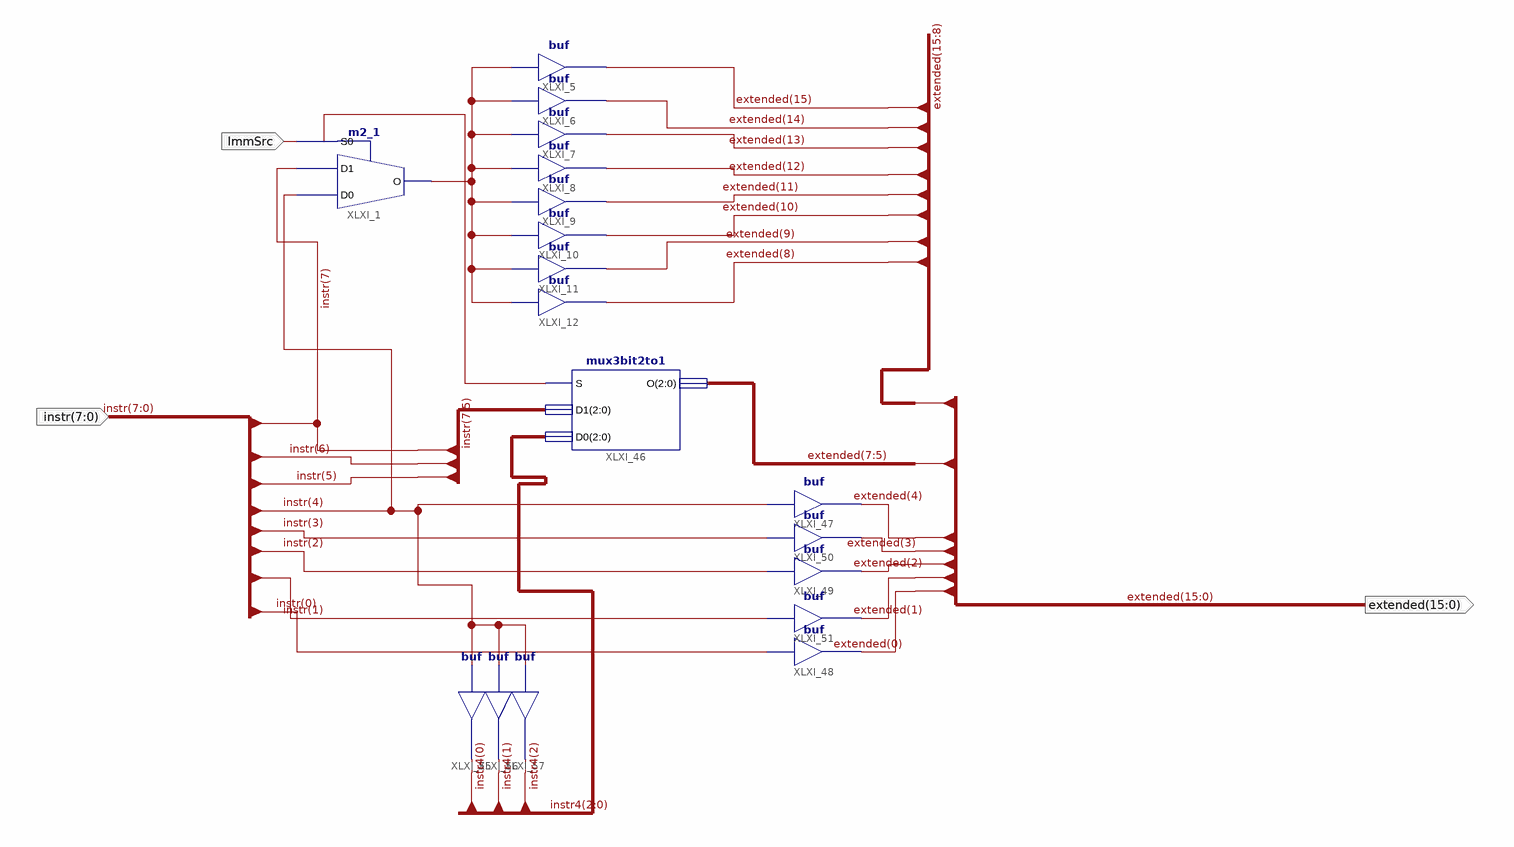
[diagram p0: schematic sheet 1]
// Xilinx ISE schematic extend.sch (spartan3e) as structural Verilog: 18 symbols, 3 ports
module extend (
  input  ImmSrc,
  input  [7:0] instr,
  output [15:0] extended
);

  wire XLXN_53, XLXN_79;
  wire [2:0] instr4;

  m2_1 XLXI_1 (.D0(instr[4]), .D1(instr[7]), .S0(ImmSrc), .O(XLXN_53));
  buf XLXI_5 (extended[15], XLXN_53);
  buf XLXI_6 (extended[14], XLXN_53);
  buf XLXI_7 (extended[13], XLXN_53);
  buf XLXI_8 (extended[12], XLXN_53);
  buf XLXI_9 (extended[11], XLXN_53);
  buf XLXI_10 (extended[10], XLXN_53);
  buf XLXI_11 (extended[9], XLXN_53);
  buf XLXI_12 (extended[8], XLXN_53);
  mux3bit2to1 XLXI_46 (.D0(instr4), .D1(instr[7:5]), .O(extended[7:5]), .S(XLXN_79));
  buf XLXI_47 (extended[4], instr[4]);
  buf XLXI_48 (extended[0], instr[0]);
  buf XLXI_49 (extended[2], instr[2]);
  buf XLXI_50 (extended[3], instr[3]);
  buf XLXI_51 (extended[1], instr[1]);
  buf XLXI_55 (instr4[0], instr[4]);
  buf XLXI_56 (instr4[1], instr[4]);
  buf XLXI_57 (instr4[2], instr[4]);
endmodule
